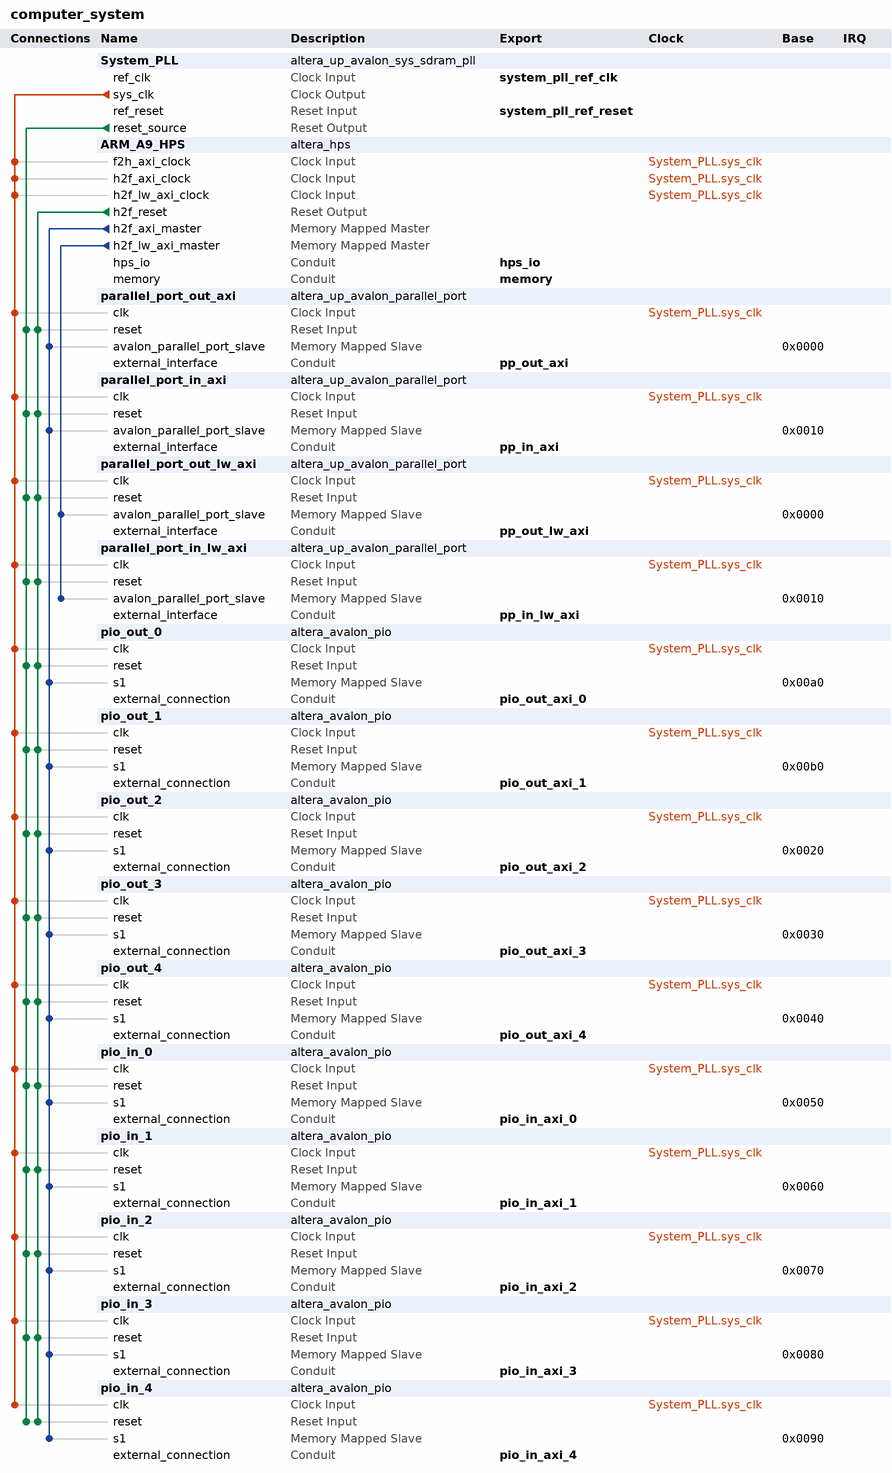
[diagram p0: system contents]
# Platform Designer (Qsys) system computer_system, Cyclone V 5CSXFC6D6F31C6
# Parameters at their usual value, and those the tool derives, are not listed.
package require -exact qsys 23.1
create_system computer_system
set_project_property DEVICE_FAMILY {Cyclone V}
set_project_property DEVICE 5CSXFC6D6F31C6

add_instance System_PLL altera_up_avalon_sys_sdram_pll 18.0
set_instance_parameter_value System_PLL CV_boards DE1-SoC
set_instance_parameter_value System_PLL gui_outclk 100.0
set_instance_parameter_value System_PLL gui_refclk 50.0

add_instance ARM_A9_HPS altera_hps 23.1
set_instance_parameter_value ARM_A9_HPS EMAC1_Mode RGMII
set_instance_parameter_value ARM_A9_HPS EMAC1_PinMuxing {HPS I/O Set 0}
set_instance_parameter_value ARM_A9_HPS F2SCLK_COLDRST_Enable false
set_instance_parameter_value ARM_A9_HPS F2SCLK_DBGRST_Enable false
set_instance_parameter_value ARM_A9_HPS F2SCLK_WARMRST_Enable false
set_instance_parameter_value ARM_A9_HPS F2SINTERRUPT_Enable true
set_instance_parameter_value ARM_A9_HPS F2S_Width 3
set_instance_parameter_value ARM_A9_HPS FPGA_PERIPHERAL_OUTPUT_CLOCK_FREQ_EMAC0_GTX_CLK 125
set_instance_parameter_value ARM_A9_HPS FPGA_PERIPHERAL_OUTPUT_CLOCK_FREQ_EMAC0_MD_CLK 100.0
set_instance_parameter_value ARM_A9_HPS FPGA_PERIPHERAL_OUTPUT_CLOCK_FREQ_EMAC1_GTX_CLK 125
set_instance_parameter_value ARM_A9_HPS FPGA_PERIPHERAL_OUTPUT_CLOCK_FREQ_EMAC1_MD_CLK 100.0
set_instance_parameter_value ARM_A9_HPS HPS_PROTOCOL DDR3
set_instance_parameter_value ARM_A9_HPS I2C0_Mode I2C
set_instance_parameter_value ARM_A9_HPS I2C0_PinMuxing {HPS I/O Set 0}
set_instance_parameter_value ARM_A9_HPS I2C1_Mode I2C
set_instance_parameter_value ARM_A9_HPS I2C1_PinMuxing {HPS I/O Set 0}
set_instance_parameter_value ARM_A9_HPS LWH2F_Enable true
set_instance_parameter_value ARM_A9_HPS MEM_BANKADDR_WIDTH 3
set_instance_parameter_value ARM_A9_HPS MEM_CLK_FREQ 400.0
set_instance_parameter_value ARM_A9_HPS MEM_COL_ADDR_WIDTH 10
set_instance_parameter_value ARM_A9_HPS MEM_DQ_WIDTH 32
set_instance_parameter_value ARM_A9_HPS MEM_DRV_STR RZQ/7
set_instance_parameter_value ARM_A9_HPS MEM_ROW_ADDR_WIDTH 15
set_instance_parameter_value ARM_A9_HPS MEM_RTT_NOM RZQ/4
set_instance_parameter_value ARM_A9_HPS MEM_RTT_WR RZQ/4
set_instance_parameter_value ARM_A9_HPS MEM_TCL 11
set_instance_parameter_value ARM_A9_HPS MEM_TFAW_NS 30.0
set_instance_parameter_value ARM_A9_HPS MEM_TRAS_NS 35.0
set_instance_parameter_value ARM_A9_HPS MEM_TRCD_NS 13.75
set_instance_parameter_value ARM_A9_HPS MEM_TRFC_NS 260.0
set_instance_parameter_value ARM_A9_HPS MEM_TRP_NS 13.75
set_instance_parameter_value ARM_A9_HPS MEM_VENDOR JEDEC
set_instance_parameter_value ARM_A9_HPS MEM_WTCL 8
set_instance_parameter_value ARM_A9_HPS QSPI_Mode {1 SS}
set_instance_parameter_value ARM_A9_HPS QSPI_PinMuxing {HPS I/O Set 0}
set_instance_parameter_value ARM_A9_HPS REF_CLK_FREQ 25.0
set_instance_parameter_value ARM_A9_HPS S2FCLK_USER2CLK 5
set_instance_parameter_value ARM_A9_HPS S2F_Width 3
set_instance_parameter_value ARM_A9_HPS SDIO_Mode {4-bit Data}
set_instance_parameter_value ARM_A9_HPS SDIO_PinMuxing {HPS I/O Set 0}
set_instance_parameter_value ARM_A9_HPS SPIM1_Mode {Single Slave Select}
set_instance_parameter_value ARM_A9_HPS SPIM1_PinMuxing {HPS I/O Set 0}
set_instance_parameter_value ARM_A9_HPS STM_Enable false
set_instance_parameter_value ARM_A9_HPS TIMING_BOARD_AC_SKEW 0.03
set_instance_parameter_value ARM_A9_HPS TIMING_BOARD_AC_TO_CK_SKEW 0.0
set_instance_parameter_value ARM_A9_HPS TIMING_BOARD_DQ_TO_DQS_SKEW 0.0
set_instance_parameter_value ARM_A9_HPS TIMING_BOARD_MAX_CK_DELAY 0.03
set_instance_parameter_value ARM_A9_HPS TIMING_BOARD_MAX_DQS_DELAY 0.02
set_instance_parameter_value ARM_A9_HPS TIMING_BOARD_SKEW_BETWEEN_DQS 0.08
set_instance_parameter_value ARM_A9_HPS TIMING_BOARD_SKEW_CKDQS_DIMM_MAX 0.16
set_instance_parameter_value ARM_A9_HPS TIMING_BOARD_SKEW_CKDQS_DIMM_MIN 0.09
set_instance_parameter_value ARM_A9_HPS TIMING_BOARD_SKEW_WITHIN_DQS 0.01
set_instance_parameter_value ARM_A9_HPS TIMING_TDH 65
set_instance_parameter_value ARM_A9_HPS TIMING_TDQSCK 255
set_instance_parameter_value ARM_A9_HPS TIMING_TDQSQ 125
set_instance_parameter_value ARM_A9_HPS TIMING_TDS 30
set_instance_parameter_value ARM_A9_HPS TIMING_TIH 140
set_instance_parameter_value ARM_A9_HPS TIMING_TIS 180
set_instance_parameter_value ARM_A9_HPS TIMING_TQSH 0.4
set_instance_parameter_value ARM_A9_HPS UART0_Mode {No Flow Control}
set_instance_parameter_value ARM_A9_HPS UART0_PinMuxing {HPS I/O Set 0}
set_instance_parameter_value ARM_A9_HPS USB1_Mode SDR
set_instance_parameter_value ARM_A9_HPS USB1_PinMuxing {HPS I/O Set 0}
set_instance_parameter_value ARM_A9_HPS desired_cfg_clk_mhz 100.0
set_instance_parameter_value ARM_A9_HPS desired_qspi_clk_mhz 400.0

add_instance parallel_port_out_axi altera_up_avalon_parallel_port 18.0
set_instance_parameter_value parallel_port_out_axi board DE2-115
set_instance_parameter_value parallel_port_out_axi capture false
set_instance_parameter_value parallel_port_out_axi custom_port true
set_instance_parameter_value parallel_port_out_axi edge Rising
set_instance_parameter_value parallel_port_out_axi irq false
set_instance_parameter_value parallel_port_out_axi preset Pushbuttons

add_instance parallel_port_in_axi altera_up_avalon_parallel_port 18.0
set_instance_parameter_value parallel_port_in_axi board DE2-115
set_instance_parameter_value parallel_port_in_axi capture false
set_instance_parameter_value parallel_port_in_axi custom_port true
set_instance_parameter_value parallel_port_in_axi edge Rising
set_instance_parameter_value parallel_port_in_axi irq false
set_instance_parameter_value parallel_port_in_axi preset Pushbuttons

add_instance parallel_port_out_lw_axi altera_up_avalon_parallel_port 18.0
set_instance_parameter_value parallel_port_out_lw_axi board DE2-115
set_instance_parameter_value parallel_port_out_lw_axi capture false
set_instance_parameter_value parallel_port_out_lw_axi custom_port true
set_instance_parameter_value parallel_port_out_lw_axi edge Rising
set_instance_parameter_value parallel_port_out_lw_axi irq false
set_instance_parameter_value parallel_port_out_lw_axi preset Pushbuttons

add_instance parallel_port_in_lw_axi altera_up_avalon_parallel_port 18.0
set_instance_parameter_value parallel_port_in_lw_axi board DE2-115
set_instance_parameter_value parallel_port_in_lw_axi capture false
set_instance_parameter_value parallel_port_in_lw_axi custom_port true
set_instance_parameter_value parallel_port_in_lw_axi edge Rising
set_instance_parameter_value parallel_port_in_lw_axi irq false
set_instance_parameter_value parallel_port_in_lw_axi preset Pushbuttons

add_instance pio_out_0 altera_avalon_pio 23.1
set_instance_parameter_value pio_out_0 direction Output
set_instance_parameter_value pio_out_0 width 32

add_instance pio_out_1 altera_avalon_pio 23.1
set_instance_parameter_value pio_out_1 direction Output
set_instance_parameter_value pio_out_1 width 32

add_instance pio_out_2 altera_avalon_pio 23.1
set_instance_parameter_value pio_out_2 direction Output
set_instance_parameter_value pio_out_2 width 32

add_instance pio_out_3 altera_avalon_pio 23.1
set_instance_parameter_value pio_out_3 direction Output
set_instance_parameter_value pio_out_3 width 32

add_instance pio_out_4 altera_avalon_pio 23.1
set_instance_parameter_value pio_out_4 direction Output
set_instance_parameter_value pio_out_4 width 32

add_instance pio_in_0 altera_avalon_pio 23.1
set_instance_parameter_value pio_in_0 direction Input
set_instance_parameter_value pio_in_0 width 32

add_instance pio_in_1 altera_avalon_pio 23.1
set_instance_parameter_value pio_in_1 direction Input
set_instance_parameter_value pio_in_1 width 32

add_instance pio_in_2 altera_avalon_pio 23.1
set_instance_parameter_value pio_in_2 direction Input
set_instance_parameter_value pio_in_2 width 32

add_instance pio_in_3 altera_avalon_pio 23.1
set_instance_parameter_value pio_in_3 direction Input
set_instance_parameter_value pio_in_3 width 32

add_instance pio_in_4 altera_avalon_pio 23.1
set_instance_parameter_value pio_in_4 direction Input
set_instance_parameter_value pio_in_4 width 32

# connections
add_connection System_PLL.sys_clk ARM_A9_HPS.f2h_axi_clock clock
add_connection System_PLL.sys_clk ARM_A9_HPS.h2f_axi_clock clock
add_connection System_PLL.sys_clk ARM_A9_HPS.h2f_lw_axi_clock clock
add_connection System_PLL.sys_clk parallel_port_in_axi.clk clock
add_connection System_PLL.sys_clk parallel_port_in_lw_axi.clk clock
add_connection System_PLL.sys_clk parallel_port_out_axi.clk clock
add_connection System_PLL.sys_clk parallel_port_out_lw_axi.clk clock
add_connection System_PLL.sys_clk pio_in_0.clk clock
add_connection System_PLL.sys_clk pio_in_1.clk clock
add_connection System_PLL.sys_clk pio_in_2.clk clock
add_connection System_PLL.sys_clk pio_in_3.clk clock
add_connection System_PLL.sys_clk pio_in_4.clk clock
add_connection System_PLL.sys_clk pio_out_0.clk clock
add_connection System_PLL.sys_clk pio_out_1.clk clock
add_connection System_PLL.sys_clk pio_out_2.clk clock
add_connection System_PLL.sys_clk pio_out_3.clk clock
add_connection System_PLL.sys_clk pio_out_4.clk clock
add_connection ARM_A9_HPS.h2f_reset parallel_port_in_axi.reset reset
add_connection ARM_A9_HPS.h2f_reset parallel_port_in_lw_axi.reset reset
add_connection ARM_A9_HPS.h2f_reset parallel_port_out_axi.reset reset
add_connection ARM_A9_HPS.h2f_reset parallel_port_out_lw_axi.reset reset
add_connection ARM_A9_HPS.h2f_reset pio_in_0.reset reset
add_connection ARM_A9_HPS.h2f_reset pio_in_1.reset reset
add_connection ARM_A9_HPS.h2f_reset pio_in_2.reset reset
add_connection ARM_A9_HPS.h2f_reset pio_in_3.reset reset
add_connection ARM_A9_HPS.h2f_reset pio_in_4.reset reset
add_connection ARM_A9_HPS.h2f_reset pio_out_0.reset reset
add_connection ARM_A9_HPS.h2f_reset pio_out_1.reset reset
add_connection ARM_A9_HPS.h2f_reset pio_out_2.reset reset
add_connection ARM_A9_HPS.h2f_reset pio_out_3.reset reset
add_connection ARM_A9_HPS.h2f_reset pio_out_4.reset reset
add_connection System_PLL.reset_source parallel_port_in_axi.reset reset
add_connection System_PLL.reset_source parallel_port_in_lw_axi.reset reset
add_connection System_PLL.reset_source parallel_port_out_axi.reset reset
add_connection System_PLL.reset_source parallel_port_out_lw_axi.reset reset
add_connection System_PLL.reset_source pio_in_0.reset reset
add_connection System_PLL.reset_source pio_in_1.reset reset
add_connection System_PLL.reset_source pio_in_2.reset reset
add_connection System_PLL.reset_source pio_in_3.reset reset
add_connection System_PLL.reset_source pio_in_4.reset reset
add_connection System_PLL.reset_source pio_out_0.reset reset
add_connection System_PLL.reset_source pio_out_1.reset reset
add_connection System_PLL.reset_source pio_out_2.reset reset
add_connection System_PLL.reset_source pio_out_3.reset reset
add_connection System_PLL.reset_source pio_out_4.reset reset
add_connection ARM_A9_HPS.h2f_axi_master parallel_port_in_axi.avalon_parallel_port_slave avalon
set_connection_parameter_value ARM_A9_HPS.h2f_axi_master/parallel_port_in_axi.avalon_parallel_port_slave baseAddress 0x0010
add_connection ARM_A9_HPS.h2f_axi_master parallel_port_out_axi.avalon_parallel_port_slave avalon
set_connection_parameter_value ARM_A9_HPS.h2f_axi_master/parallel_port_out_axi.avalon_parallel_port_slave baseAddress 0x0000
add_connection ARM_A9_HPS.h2f_axi_master pio_in_0.s1 avalon
set_connection_parameter_value ARM_A9_HPS.h2f_axi_master/pio_in_0.s1 baseAddress 0x0050
add_connection ARM_A9_HPS.h2f_axi_master pio_in_1.s1 avalon
set_connection_parameter_value ARM_A9_HPS.h2f_axi_master/pio_in_1.s1 baseAddress 0x0060
add_connection ARM_A9_HPS.h2f_axi_master pio_in_2.s1 avalon
set_connection_parameter_value ARM_A9_HPS.h2f_axi_master/pio_in_2.s1 baseAddress 0x0070
add_connection ARM_A9_HPS.h2f_axi_master pio_in_3.s1 avalon
set_connection_parameter_value ARM_A9_HPS.h2f_axi_master/pio_in_3.s1 baseAddress 0x0080
add_connection ARM_A9_HPS.h2f_axi_master pio_in_4.s1 avalon
set_connection_parameter_value ARM_A9_HPS.h2f_axi_master/pio_in_4.s1 baseAddress 0x0090
add_connection ARM_A9_HPS.h2f_axi_master pio_out_0.s1 avalon
set_connection_parameter_value ARM_A9_HPS.h2f_axi_master/pio_out_0.s1 baseAddress 0x00a0
add_connection ARM_A9_HPS.h2f_axi_master pio_out_1.s1 avalon
set_connection_parameter_value ARM_A9_HPS.h2f_axi_master/pio_out_1.s1 baseAddress 0x00b0
add_connection ARM_A9_HPS.h2f_axi_master pio_out_2.s1 avalon
set_connection_parameter_value ARM_A9_HPS.h2f_axi_master/pio_out_2.s1 baseAddress 0x0020
add_connection ARM_A9_HPS.h2f_axi_master pio_out_3.s1 avalon
set_connection_parameter_value ARM_A9_HPS.h2f_axi_master/pio_out_3.s1 baseAddress 0x0030
add_connection ARM_A9_HPS.h2f_axi_master pio_out_4.s1 avalon
set_connection_parameter_value ARM_A9_HPS.h2f_axi_master/pio_out_4.s1 baseAddress 0x0040
add_connection ARM_A9_HPS.h2f_lw_axi_master parallel_port_in_lw_axi.avalon_parallel_port_slave avalon
set_connection_parameter_value ARM_A9_HPS.h2f_lw_axi_master/parallel_port_in_lw_axi.avalon_parallel_port_slave baseAddress 0x0010
add_connection ARM_A9_HPS.h2f_lw_axi_master parallel_port_out_lw_axi.avalon_parallel_port_slave avalon
set_connection_parameter_value ARM_A9_HPS.h2f_lw_axi_master/parallel_port_out_lw_axi.avalon_parallel_port_slave baseAddress 0x0000

# exported interfaces
add_interface hps_io conduit end
set_interface_property hps_io EXPORT_OF ARM_A9_HPS.hps_io
add_interface memory conduit end
set_interface_property memory EXPORT_OF ARM_A9_HPS.memory
add_interface pio_in_axi_0 conduit end
set_interface_property pio_in_axi_0 EXPORT_OF pio_in_0.external_connection
add_interface pio_in_axi_1 conduit end
set_interface_property pio_in_axi_1 EXPORT_OF pio_in_1.external_connection
add_interface pio_in_axi_2 conduit end
set_interface_property pio_in_axi_2 EXPORT_OF pio_in_2.external_connection
add_interface pio_in_axi_3 conduit end
set_interface_property pio_in_axi_3 EXPORT_OF pio_in_3.external_connection
add_interface pio_in_axi_4 conduit end
set_interface_property pio_in_axi_4 EXPORT_OF pio_in_4.external_connection
add_interface pio_out_axi_0 conduit end
set_interface_property pio_out_axi_0 EXPORT_OF pio_out_0.external_connection
add_interface pio_out_axi_1 conduit end
set_interface_property pio_out_axi_1 EXPORT_OF pio_out_1.external_connection
add_interface pio_out_axi_2 conduit end
set_interface_property pio_out_axi_2 EXPORT_OF pio_out_2.external_connection
add_interface pio_out_axi_3 conduit end
set_interface_property pio_out_axi_3 EXPORT_OF pio_out_3.external_connection
add_interface pio_out_axi_4 conduit end
set_interface_property pio_out_axi_4 EXPORT_OF pio_out_4.external_connection
add_interface pp_in_axi conduit end
set_interface_property pp_in_axi EXPORT_OF parallel_port_in_axi.external_interface
add_interface pp_in_lw_axi conduit end
set_interface_property pp_in_lw_axi EXPORT_OF parallel_port_in_lw_axi.external_interface
add_interface pp_out_axi conduit end
set_interface_property pp_out_axi EXPORT_OF parallel_port_out_axi.external_interface
add_interface pp_out_lw_axi conduit end
set_interface_property pp_out_lw_axi EXPORT_OF parallel_port_out_lw_axi.external_interface
add_interface system_pll_ref_clk clock sink
set_interface_property system_pll_ref_clk EXPORT_OF System_PLL.ref_clk
add_interface system_pll_ref_reset reset sink
set_interface_property system_pll_ref_reset EXPORT_OF System_PLL.ref_reset

set_interconnect_requirement {$system} qsys_mm.clockCrossingAdapter HANDSHAKE
set_interconnect_requirement {$system} qsys_mm.enableEccProtection FALSE
set_interconnect_requirement {$system} qsys_mm.insertDefaultSlave FALSE
set_interconnect_requirement {$system} qsys_mm.maxAdditionalLatency 1

save_system computer_system.qsys
